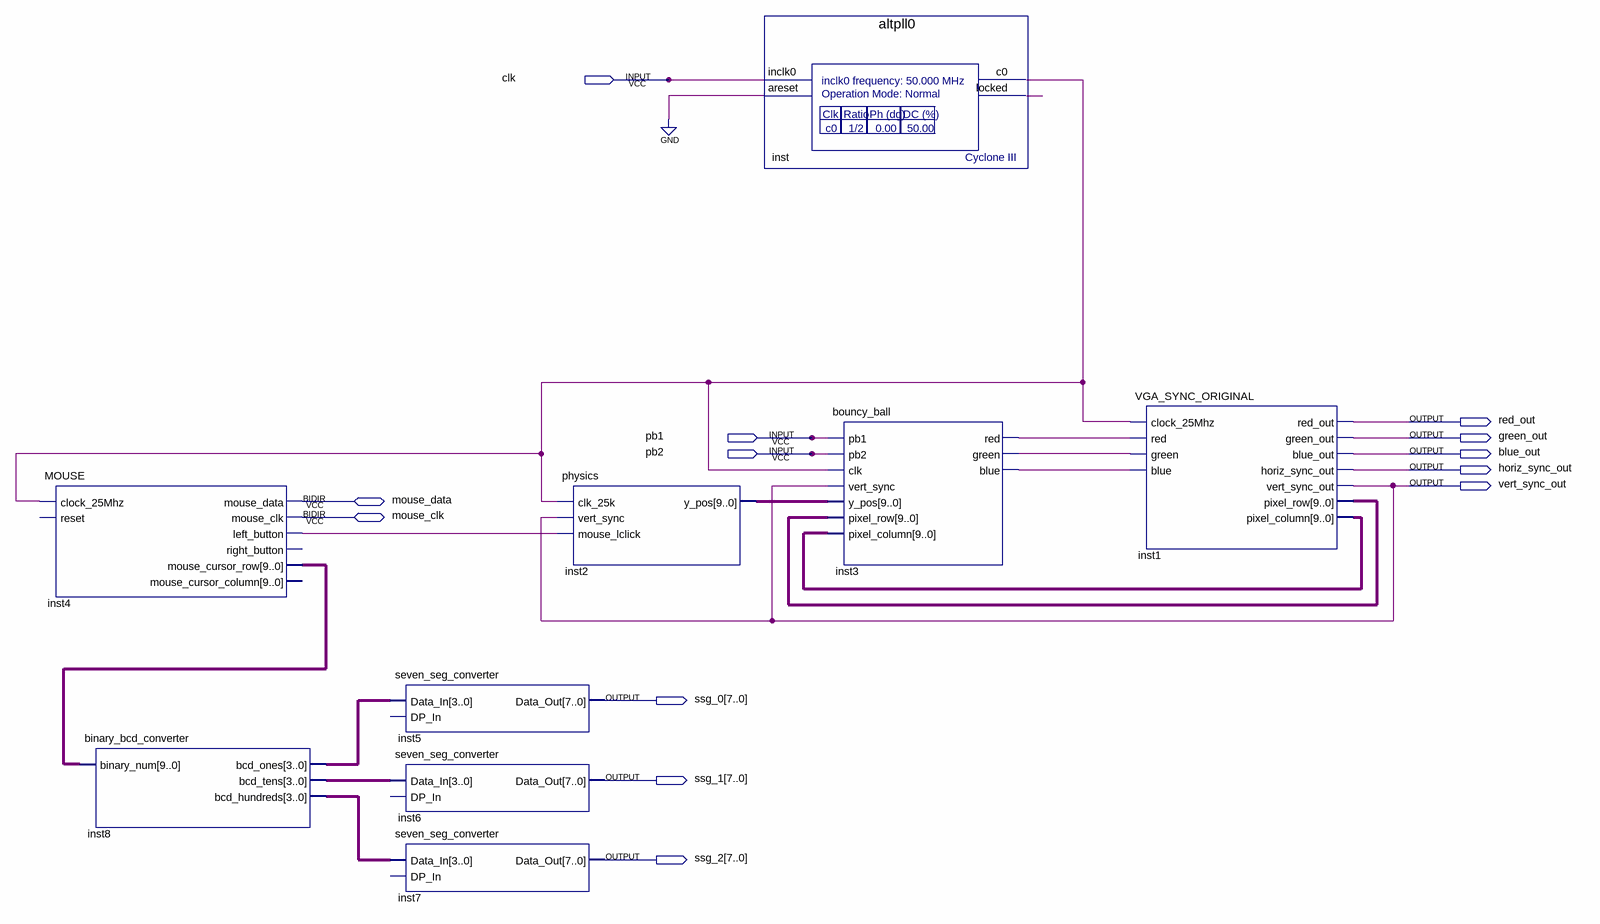
[diagram p0: schematic sheet]
// Quartus schematic physics_test_schematic.bdf as structural Verilog: 9 symbols, 13 pins
module physics_test_schematic (
  input  clk,
  input  pb1,
  input  pb2,
  inout  mouse_data,
  inout  mouse_clk,
  output red_out,
  output green_out,
  output blue_out,
  output horiz_sync_out,
  output vert_sync_out,
  output [7:0] ssg_0,
  output [7:0] ssg_1,
  output [7:0] ssg_2
);

  wire inst3_blue, inst3_green, inst3_red, inst4_left_button, inst_c0, inst_locked;
  wire [3:0] inst8_bcd_hundreds, inst8_bcd_ones, inst8_bcd_tens;
  wire [9:0] inst1_pixel_column, inst1_pixel_row, inst2_y_pos, inst4_mouse_cursor_row;

  MOUSE inst4 (
    .clock_25Mhz(inst_c0), .left_button(inst4_left_button), .mouse_cursor_row(inst4_mouse_cursor_row),
    .mouse_data(mouse_data), .mouse_clk(mouse_clk));  // open: reset, right_button, mouse_cursor_column
  binary_bcd_converter inst8 (
    .binary_num(inst4_mouse_cursor_row), .bcd_ones(inst8_bcd_ones), .bcd_tens(inst8_bcd_tens),
    .bcd_hundreds(inst8_bcd_hundreds));
  seven_seg_converter inst5 (.Data_In(inst8_bcd_ones), .Data_Out(ssg_0));  // open: DP_In
  seven_seg_converter inst6 (.Data_In(inst8_bcd_tens), .Data_Out(ssg_1));  // open: DP_In
  seven_seg_converter inst7 (.Data_In(inst8_bcd_hundreds), .Data_Out(ssg_2));  // open: DP_In
  physics inst2 (.clk_25k(inst_c0), .vert_sync(vert_sync_out), .mouse_lclick(inst4_left_button), .y_pos(inst2_y_pos));
  altpll0 inst (.inclk0(clk), .areset(1'b0), .c0(inst_c0), .locked(inst_locked));
  bouncy_ball inst3 (
    .pb1(pb1), .pb2(pb2), .clk(inst_c0), .vert_sync(vert_sync_out), .y_pos(inst2_y_pos),
    .pixel_row(inst1_pixel_row), .pixel_column(inst1_pixel_column), .red(inst3_red), .green(inst3_green),
    .blue(inst3_blue));
  VGA_SYNC_ORIGINAL inst1 (
    .clock_25Mhz(inst_c0), .red(inst3_red), .green(inst3_green), .blue(inst3_blue), .red_out(red_out),
    .green_out(green_out), .blue_out(blue_out), .horiz_sync_out(horiz_sync_out),
    .vert_sync_out(vert_sync_out), .pixel_row(inst1_pixel_row), .pixel_column(inst1_pixel_column));
endmodule
